# EAGLE schematic Backplane schm (EAGLE 7.6.0)
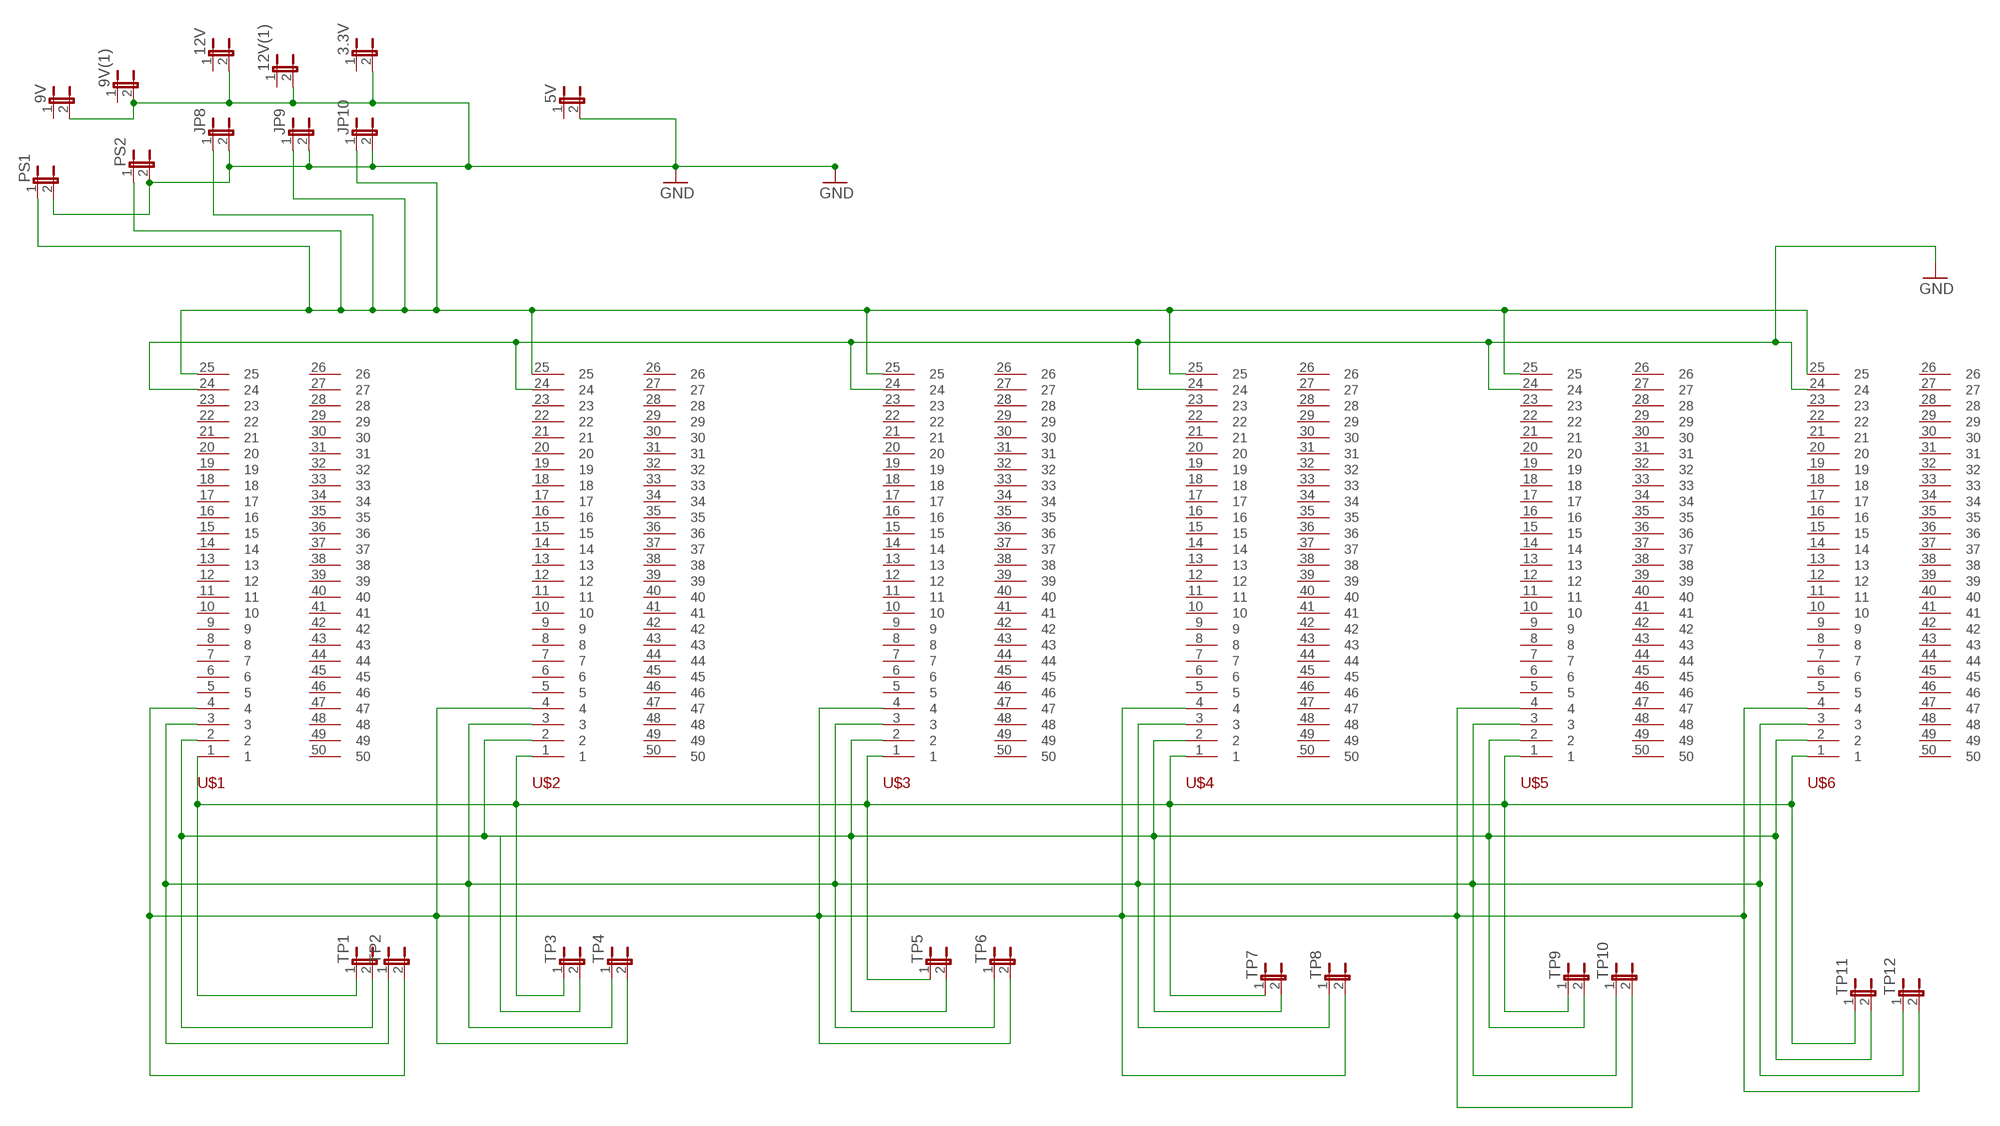
[diagram p0: schematic, sheet 1]

## Parts
3.3V  JP1E  [JP1]
5V  JP1E  [JP1]
9V  JP1E  [JP1]
9V(1)  JP1E  [JP1]
12V  JP1E  [JP1]
12V(1)  JP1E  [JP1]
JP8  JP1E  [JP1]
JP9  JP1E  [JP1]
JP10  JP1E  [JP1]
PS1  JP1E  [JP1]
PS2  JP1E  [JP1]
TP1  JP1E  [JP1]
TP2  JP1E  [JP1]
TP3  JP1E  [JP1]
TP4  JP1E  [JP1]
TP5  JP1E  [JP1]
TP6  JP1E  [JP1]
TP7  JP1E  [JP1]
TP8  JP1E  [JP1]
TP9  JP1E  [JP1]
TP10  JP1E  [JP1]
TP11  JP1E  [JP1]
TP12  JP1E  [JP1]
U$1  NG_CD_6364666_D-669581  [CON25]
U$2  NG_CD_6364666_D-669581  [CON25]
U$3  NG_CD_6364666_D-669581  [CON25]
U$4  NG_CD_6364666_D-669581  [CON25]
U$5  NG_CD_6364666_D-669581  [CON25]
U$6  NG_CD_6364666_D-669581  [CON25]

## Nets
5: TP1.1 TP3.1 TP5.1 TP7.1 TP9.1 TP11.1 U$1.1 U$2.1 U$3.1 U$4.1 U$5.1 U$6.1
GND: 3.3V.2 5V.2 9V(1).2 9V.2 12V(1).2 12V.2 JP8.2 JP9.2 JP10.2 PS1.2 PS2.2 U$1.24 U$2.24 U$3.24 U$4.24 U$5.24 U$6.24
N$2: TP1.2 TP3.2 TP5.2 TP7.2 TP9.2 TP11.2 U$1.2 U$2.2 U$3.2 U$4.2 U$5.2 U$6.2
N$3: TP2.1 TP4.1 TP6.1 TP8.1 TP10.1 TP12.1 U$1.3 U$2.3 U$3.3 U$4.3 U$5.3 U$6.3
N$4: TP2.2 TP4.2 TP6.2 TP8.2 TP10.2 TP12.2 U$1.4 U$2.4 U$3.4 U$4.4 U$5.4 U$6.4
N$5: JP8.1 JP9.1 JP10.1 PS1.1 PS2.1 U$1.25 U$2.25 U$3.25 U$4.25 U$5.25 U$6.25
Unconnected: 3.3V.1 5V.1 9V(1).1 9V.1 12V(1).1 12V.1 U$1.5 U$1.6 U$1.7 U$1.8 U$1.9 U$1.10 U$1.11 U$1.12 U$1.13 U$1.14 U$1.15 U$1.16 U$1.17 U$1.18 U$1.19 U$1.20 U$1.21 U$1.22 U$1.23 U$1.26 U$1.27 U$1.28 U$1.29 U$1.30 U$1.31 U$1.32 U$1.33 U$1.34 U$1.35 U$1.36 U$1.37 U$1.38 U$1.39 U$1.40 U$1.41 U$1.42 U$1.43 U$1.44 U$1.45 U$1.46 U$1.47 U$1.48 U$1.49 U$1.50 U$2.5 U$2.6 U$2.7 U$2.8 U$2.9 U$2.10 U$2.11 U$2.12 U$2.13 U$2.14 U$2.15 U$2.16 U$2.17 U$2.18 U$2.19 U$2.20 U$2.21 U$2.22 U$2.23 U$2.26 U$2.27 U$2.28 U$2.29 U$2.30 U$2.31 U$2.32 U$2.33 U$2.34 U$2.35 U$2.36 U$2.37 U$2.38 U$2.39 U$2.40 U$2.41 U$2.42 U$2.43 U$2.44 U$2.45 U$2.46 U$2.47 U$2.48 U$2.49 U$2.50 U$3.5 U$3.6 U$3.7 U$3.8 U$3.9 U$3.10 U$3.11 U$3.12 U$3.13 U$3.14 U$3.15 U$3.16 U$3.17 U$3.18 U$3.19 U$3.20 U$3.21 U$3.22 U$3.23 U$3.26 U$3.27 U$3.28 U$3.29 U$3.30 U$3.31 U$3.32 U$3.33 U$3.34 U$3.35 U$3.36 U$3.37 U$3.38 U$3.39 U$3.40 U$3.41 U$3.42 U$3.43 U$3.44 U$3.45 U$3.46 U$3.47 U$3.48 U$3.49 U$3.50 U$4.5 U$4.6 U$4.7 U$4.8 U$4.9 U$4.10 U$4.11 U$4.12 U$4.13 U$4.14 U$4.15 U$4.16 U$4.17 U$4.18 U$4.19 U$4.20 U$4.21 U$4.22 U$4.23 U$4.26 U$4.27 U$4.28 U$4.29 U$4.30 U$4.31 U$4.32 U$4.33 U$4.34 U$4.35 U$4.36 U$4.37 U$4.38 U$4.39 U$4.40 U$4.41 U$4.42 U$4.43 U$4.44 U$4.45 U$4.46 U$4.47 U$4.48 U$4.49 U$4.50 U$5.5 U$5.6 U$5.7 U$5.8 U$5.9 U$5.10 U$5.11 U$5.12 U$5.13 U$5.14 U$5.15 U$5.16 U$5.17 U$5.18 U$5.19 U$5.20 U$5.21 U$5.22 U$5.23 U$5.26 U$5.27 U$5.28 U$5.29 U$5.30 U$5.31 U$5.32 U$5.33 U$5.34 U$5.35 U$5.36 U$5.37 U$5.38 U$5.39 U$5.40 U$5.41 U$5.42 U$5.43 U$5.44 U$5.45 U$5.46 U$5.47 U$5.48 U$5.49 U$5.50 U$6.5 U$6.6 U$6.7 U$6.8 U$6.9 U$6.10 U$6.11 U$6.12 U$6.13 U$6.14 U$6.15 U$6.16 U$6.17 U$6.18 U$6.19 U$6.20 U$6.21 U$6.22 U$6.23 U$6.26 U$6.27 U$6.28 U$6.29 U$6.30 U$6.31 U$6.32 U$6.33 U$6.34 U$6.35 U$6.36 U$6.37 U$6.38 U$6.39 U$6.40 U$6.41 U$6.42 U$6.43 U$6.44 U$6.45 U$6.46 U$6.47 U$6.48 U$6.49 U$6.50

## Library data of the parts
3.3V 5V 9V 9V(1) 12V 12V(1) JP8-JP10 PS1 PS2 TP1-TP12 = jumper:JP1E: JUMPER
U$1-U$6 = Linear-zif-connector:NG_CD_6364666_D-669581